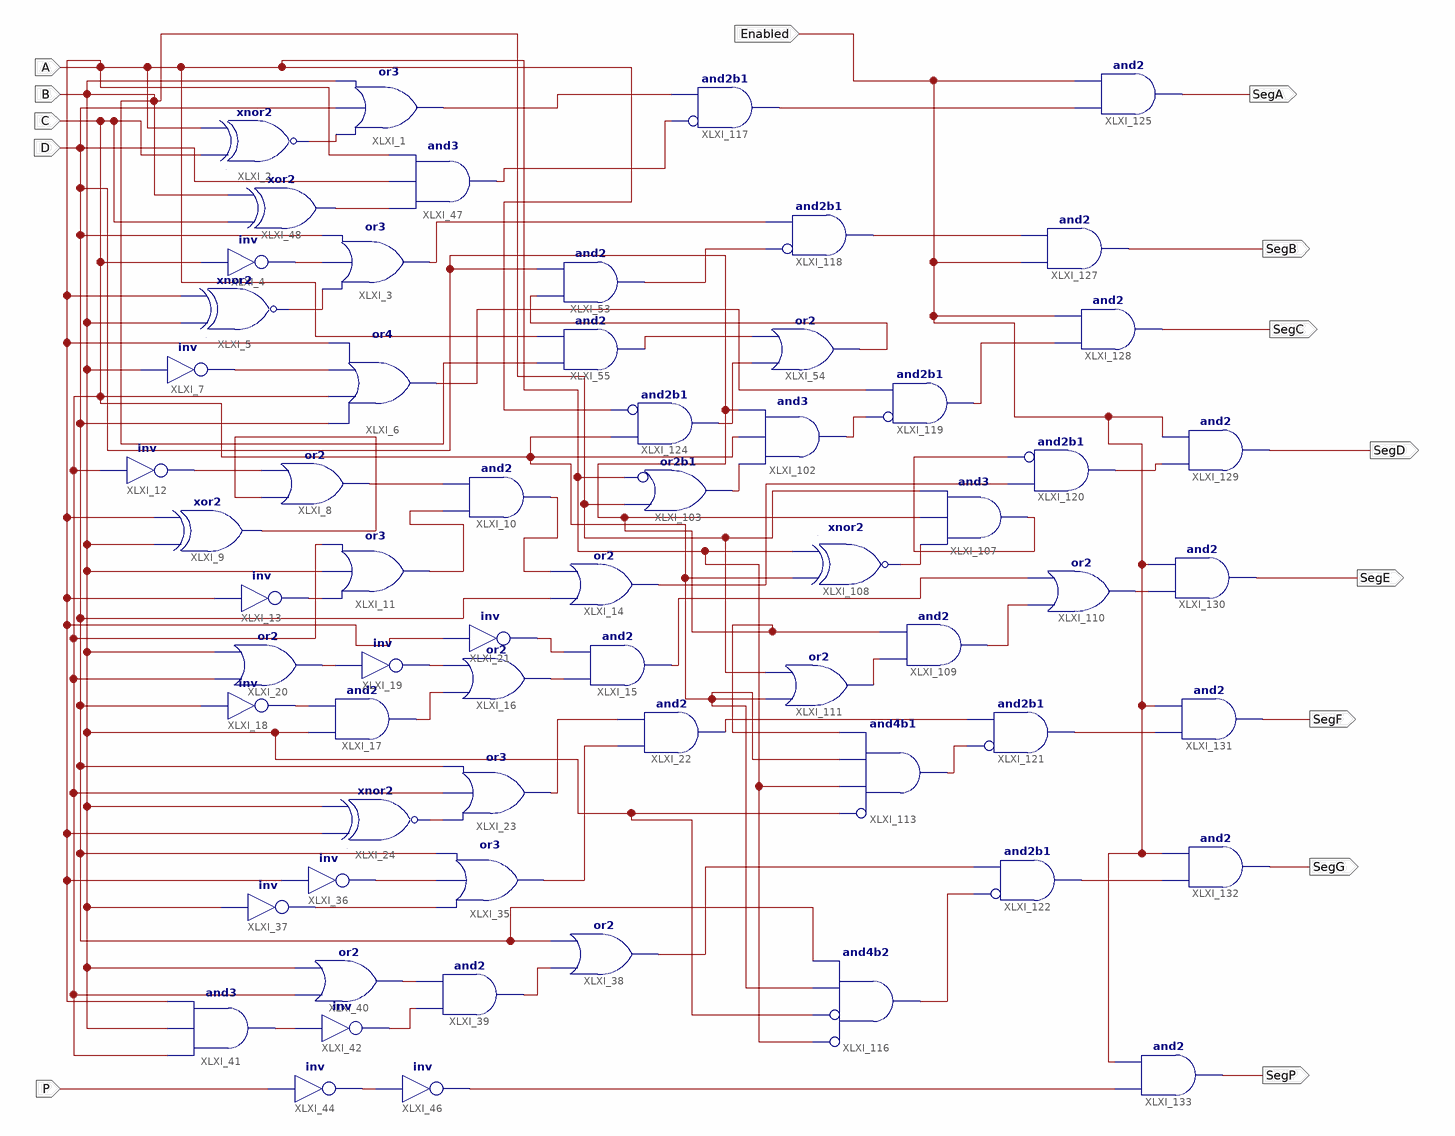
[diagram p0: schematic sheet 1]
// Xilinx ISE schematic Svn2.sch (spartan6) as structural Verilog: 63 symbols, 14 ports
module Svn2 (
  input  C,
  input  D,
  input  P,
  input  B,
  input  A,
  input  Enabled,
  output SegA,
  output SegB,
  output SegC,
  output SegD,
  output SegE,
  output SegF,
  output SegG,
  output SegP
);

  wire m, n, o, s, XLXN_1, XLXN_9, XLXN_10, XLXN_11, XLXN_39, XLXN_40, XLXN_41, XLXN_42, XLXN_43, XLXN_44,
       XLXN_45, XLXN_46, XLXN_52, XLXN_53, XLXN_54, XLXN_55, XLXN_56, XLXN_57, XLXN_58, XLXN_59, XLXN_79,
       XLXN_91, XLXN_93, XLXN_107, XLXN_110, XLXN_112, XLXN_113, XLXN_114, XLXN_116, XLXN_120, XLXN_122,
       XLXN_136, XLXN_139, XLXN_146, XLXN_147, XLXN_211, XLXN_214, XLXN_215, XLXN_219, XLXN_222, XLXN_223,
       XLXN_236, XLXN_240, XLXN_246, XLXN_253, XLXN_258, XLXN_260, XLXN_265, XLXN_267;

  or XLXI_3 (m, XLXN_10, XLXN_9, D);
  not XLXI_4 (XLXN_9, C);
  xnor XLXI_5 (XLXN_10, B, A);
  or XLXI_6 (o, D, C, XLXN_11, A);
  not XLXI_7 (XLXN_11, B);
  or XLXI_8 (XLXN_39, XLXN_41, XLXN_40);
  xor XLXI_9 (XLXN_41, B, A);
  and XLXI_10 (XLXN_79, XLXN_42, XLXN_39);
  or XLXI_11 (XLXN_42, XLXN_43, B, C);
  not XLXI_12 (XLXN_40, C);
  not XLXI_13 (XLXN_43, A);
  or XLXI_16 (XLXN_44, XLXN_45, XLXN_52);
  and XLXI_17 (XLXN_45, B, XLXN_46);
  not XLXI_18 (XLXN_46, D);
  not XLXI_19 (XLXN_52, XLXN_53);
  or XLXI_20 (XLXN_53, C, B);
  not XLXI_21 (XLXN_54, A);
  or XLXI_23 (XLXN_93, XLXN_55, C, D);
  xnor XLXI_24 (XLXN_55, A, B);
  or XLXI_35 (XLXN_56, XLXN_58, XLXN_57, D);
  not XLXI_36 (XLXN_57, A);
  not XLXI_37 (XLXN_58, B);
  or XLXI_38 (XLXN_110, XLXN_59, D);
  and XLXI_39 (XLXN_59, XLXN_114, XLXN_112);
  or XLXI_40 (XLXN_112, C, B);
  and XLXI_41 (XLXN_113, C, B, A);
  not XLXI_42 (XLXN_114, XLXN_113);
  not XLXI_44 (XLXN_116, P);
  not XLXI_46 (XLXN_267, XLXN_116);
  or XLXI_1 (XLXN_122, XLXN_1, D, B);
  xnor XLXI_2 (XLXN_1, C, A);
  and XLXI_47 (n, XLXN_120, D, A);
  xor XLXI_48 (XLXN_120, C, B);
  and XLXI_53 (XLXN_147, XLXN_136, D);
  or XLXI_54 (XLXN_136, XLXN_146, XLXN_139);
  and XLXI_55 (XLXN_139, B, A);
  and XLXI_102 (XLXN_211, XLXN_214, C, D);
  or XLXI_14 (XLXN_91, D, XLXN_79);
  or XLXI_103 (XLXN_214, ~A, B);  // or2b1
  and XLXI_107 (XLXN_215, B, D, XLXN_219);
  xnor XLXI_108 (XLXN_219, A, C);
  or XLXI_110 (XLXN_258, s, XLXN_222);
  and XLXI_109 (XLXN_222, D, XLXN_223);
  or XLXI_111 (XLXN_223, B, C);
  and XLXI_15 (s, XLXN_44, XLXN_54);
  and XLXI_22 (XLXN_107, XLXN_56, XLXN_93);
  and XLXI_113 (XLXN_236, ~B, A, C, D);  // and4b1
  and XLXI_116 (XLXN_240, ~A, ~B, C, D);  // and4b2
  and XLXI_117 (SegA, ~n, XLXN_122);  // and2b1
  and XLXI_118 (XLXN_246, ~XLXN_147, m);  // and2b1
  and XLXI_119 (SegC, ~XLXN_211, o);  // and2b1
  and XLXI_120 (XLXN_253, ~XLXN_215, XLXN_91);  // and2b1
  and XLXI_121 (XLXN_260, ~XLXN_236, XLXN_107);  // and2b1
  and XLXI_122 (XLXN_265, ~XLXN_240, XLXN_110);  // and2b1
  and XLXI_124 (XLXN_146, ~A, C);  // and2b1
  and XLXI_125 (SegA, SegA, Enabled);
  and XLXI_127 (SegB, Enabled, XLXN_246);
  and XLXI_128 (SegC, SegC, Enabled);
  and XLXI_129 (SegD, XLXN_253, Enabled);
  and XLXI_130 (SegE, XLXN_258, Enabled);
  and XLXI_131 (SegF, XLXN_260, Enabled);
  and XLXI_132 (SegG, XLXN_265, Enabled);
  and XLXI_133 (SegP, XLXN_267, Enabled);
endmodule
